# EAGLE design general_purpose_to247_hbridge_rev2 (EAGLE 6.1)
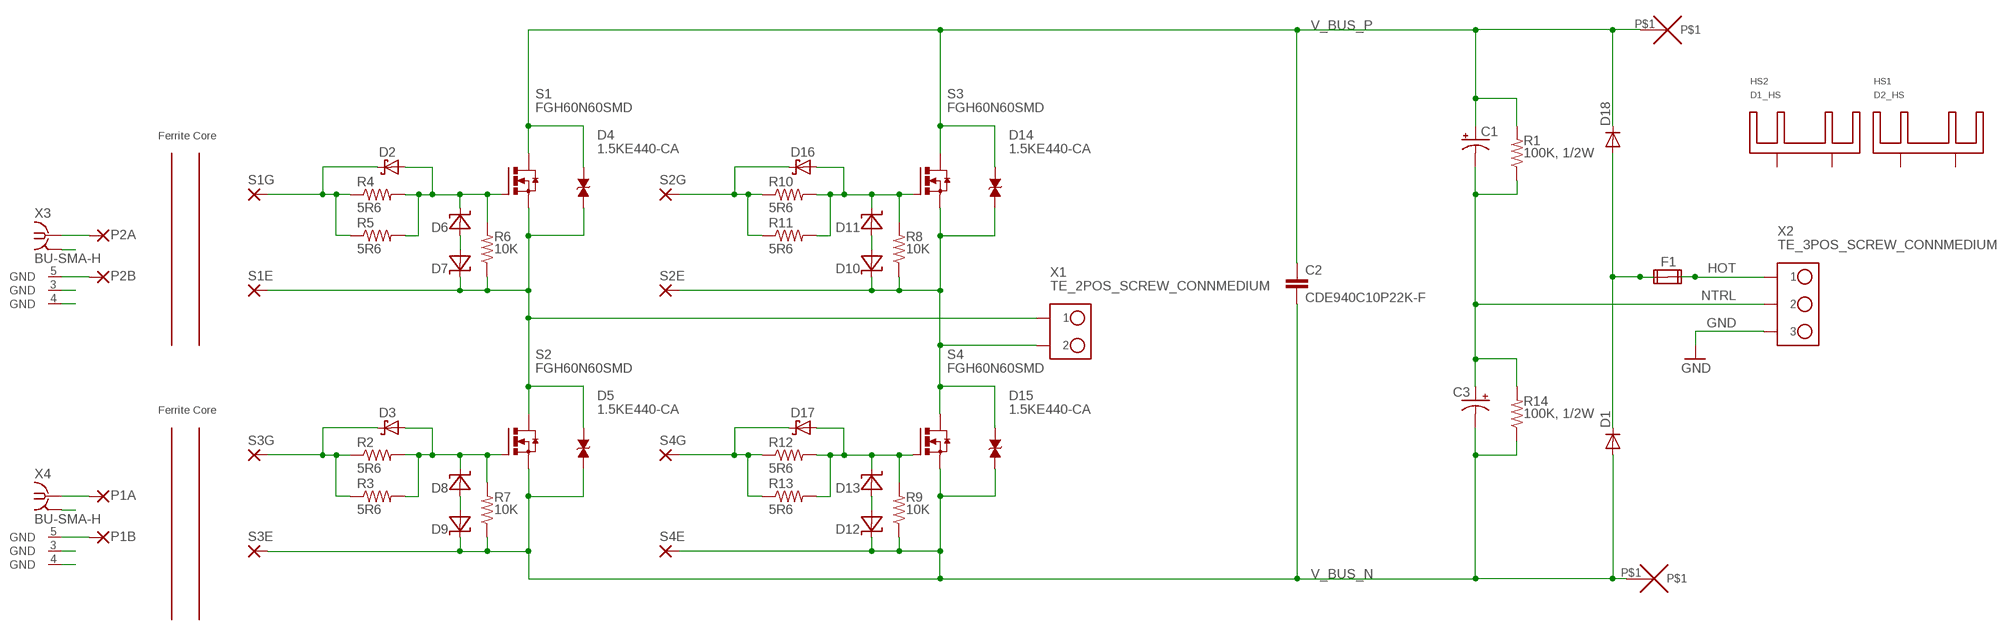
[diagram p0: schematic, sheet 1]

## Parts
C1  CPOL-USE10-35  [EB35D]
C2  CDE940C10P22K-F  [940C10P22K-F]
C3  CPOL-USE10-35  [EB35D]
D1  DIODE-DO220S  [DO220S]
D2  SCHOTTKY_SMA  [SMA]
D3  SCHOTTKY_SMA  [SMA]
D4  1.5KE440-CA  1.5KEXXX-CA  [DO-201_BI]
D5  1.5KE440-CA  1.5KEXXX-CA  [DO-201_BI]
D6  ZENER_SMA  [SMA]
D7  ZENER_SMA  [SMA]
D8  ZENER_SMA  [SMA]
D9  ZENER_SMA  [SMA]
D10  ZENER_SMA  [SMA]
D11  ZENER_SMA  [SMA]
D12  ZENER_SMA  [SMA]
D13  ZENER_SMA  [SMA]
D14  1.5KE440-CA  1.5KEXXX-CA  [DO-201_BI]
D15  1.5KE440-CA  1.5KEXXX-CA  [DO-201_BI]
D16  SCHOTTKY_SMA  [SMA]
D17  SCHOTTKY_SMA  [SMA]
D18  DIODE-DO220S  [DO220S]
F1  FUSE2P  [FUSE1]
HS1  D2_HS  HEATSINK_V6560R  [V6560_HEATSINK_REVERSED]
HS2  D1_HS  HEATSINK_V6560R  [V6560_HEATSINK_REVERSED]
P1A  SMD5  [SMD2,54-5,08]
P1B  SMD5  [SMD2,54-5,08]
P2A  SMD5  [SMD2,54-5,08]
P2B  SMD5  [SMD2,54-5,08]
R1  100K, 1/2W  R-US_0309/12  [0309/12]
R2  5R6  R-US_R2010  [R2010]
R3  5R6  R-US_R0805  [R0805]
R4  5R6  R-US_R2010  [R2010]
R5  5R6  R-US_R0805  [R0805]
R6  10K  R-US_R0805  [R0805]
R7  10K  R-US_R0805  [R0805]
R8  10K  R-US_R0805  [R0805]
R9  10K  R-US_R0805  [R0805]
R10  5R6  R-US_R2010  [R2010]
R11  5R6  R-US_R0805  [R0805]
R12  5R6  R-US_R2010  [R2010]
R13  5R6  R-US_R0805  [R0805]
R14  100K, 1/2W  R-US_0309/12  [0309/12]
S1  FGH60N60SMD  MOSFET-N_TO247  [TO247_H_NOHOLE]
S1E  SMD5  [SMD2,54-5,08]
S1G  SMD5  [SMD2,54-5,08]
S2  FGH60N60SMD  MOSFET-N_TO247  [TO247_H_NOHOLE]
S2E  SMD5  [SMD2,54-5,08]
S2G  SMD5  [SMD2,54-5,08]
S3  FGH60N60SMD  MOSFET-N_TO247  [TO247_H_NOHOLE]
S3E  SMD5  [SMD2,54-5,08]
S3G  SMD5  [SMD2,54-5,08]
S4  FGH60N60SMD  MOSFET-N_TO247  [TO247_H_NOHOLE]
S4E  SMD5  [SMD2,54-5,08]
S4G  SMD5  [SMD2,54-5,08]
U$1  12AWG_PAD  [12AWG_PAD]
U$2  GDT_SYMBOL  [GDT]
U$3  12AWG_PAD  [12AWG_PAD]
U$4  GDT_SYMBOL  [GDT]
X1  TE_2POS_SCREW_CONNMEDIUM  [OST_2POS_SCREW_CON_OSTYK51102030]
X2  TE_3POS_SCREW_CONNMEDIUM  [OST_2POS_SCREW_CON_SOTYK51103030]
X3  BU-SMA-H  [BU-SMA-H]
X4  BU-SMA-H  [BU-SMA-H]

## Nets
GND: X2.P$3
HOT: F1.2A F1.2B X2.P$1
N$1: X4.4(GND)
N$2: X4.3(GND)
N$3: P1B.1(P) X4.5(GND)
N$4: D1.C D18.A F1.1A F1.1B
N$5: D11.C D16.A R8.2 R10.2 R11.2 S3.G
N$6: P2B.1(P) X3.5(GND)
N$7: X3.4(GND)
N$8: D13.C D17.A R9.2 R12.2 R13.2 S4.G
N$9: D3.A D8.C R2.2 R3.2 R7.2 S2.G
N$10: D6.A D7.A
N$11: D2.A D6.C R4.2 R5.2 R6.2 S1.G
N$12: D8.A D9.A
N$13: D12.A D13.A
N$14: D10.A D11.A
N$15: P1A.1(P) X4.1
N$16: X3.3(GND)
N$17: P2A.1(P) X3.1
N$18: X4.2(GND)
N$19: X3.2(GND)
NTRL: C1.- C3.+ R1.1 R14.2 X2.P$2
S1E: D4.A D5.C D7.C R6.1 S1.S S1E.1(P) S2.D X1.P$1
S1G: D2.C R4.1 R5.1 S1G.1(P)
S2E: D10.C D14.A D15.C R8.1 S2E.1(P) S3.S S4.D X1.P$2
S2G: D16.C R10.1 R11.1 S2G.1(P)
S3G: D3.C R2.1 R3.1 S3G.1(P)
S4G: D17.C R12.1 R13.1 S4G.1(P)
V_BUS_N: C2.P$2 C3.- D1.A D5.A D9.C D12.C D15.A R7.1 R9.1 R14.1 S2.S S3E.1(P) S4.S S4E.1(P) U$1.P$1
V_BUS_P: C1.+ C2.P$1 D4.C D14.C D18.C R1.2 S1.D S3.D U$3.P$1
Unconnected: HS1.P$1(P1) HS1.P$2(P2) HS2.P$1(P1) HS2.P$2(P2)

## Library data of the parts
C1 C3 = resistor:CPOL-US: POLARIZED CAPACITOR, American symbol
C2 = Kramnik's Library:CDE940C10P22K-F
D1 D18 = diode:DIODE-: DIODE
D2 D3 D16 D17 = sc_usercreated:SCHOTTKY_SMA
D4 D5 D14 D15 = Kramnik's Library:1.5KEXXX-CA
D6-D13 = SC's Library:ZENER_SMA
F1 = special:FUSE2P: FUSE 5 x 20 mm
HS1 HS2 = Kramnik's Library:HEATSINK_V6560
P1A P1B P2A P2B S1E S1G S2E S2G S3E S3G S4E S4G = wirepad:SMD5: SMD PAD
R1-R14 = rcl:R-US_: RESISTOR, American symbol
S1-S4 = sc_usercreated:MOSFET-N_TO247
U$1 U$3 = onecoil:12AWG_PAD
U$2 U$4 = Kramnik's Library:GDT_SYMBOL
X1 = Kramnik's Library:TE_2POS_SCREW_CONN
X2 = Kramnik's Library:TE_3POS_SCREW_CONN
X3 X4 = con-coax:BU-SMA-H: FEMALE SMA CONNECTOR Radiall; OC_FARNELL: unknown; OC_NEWARK: unknown

## Net classes
0 default: width 0.229 mm, drill 0.381 mm, clearance 0.203 mm

## Board
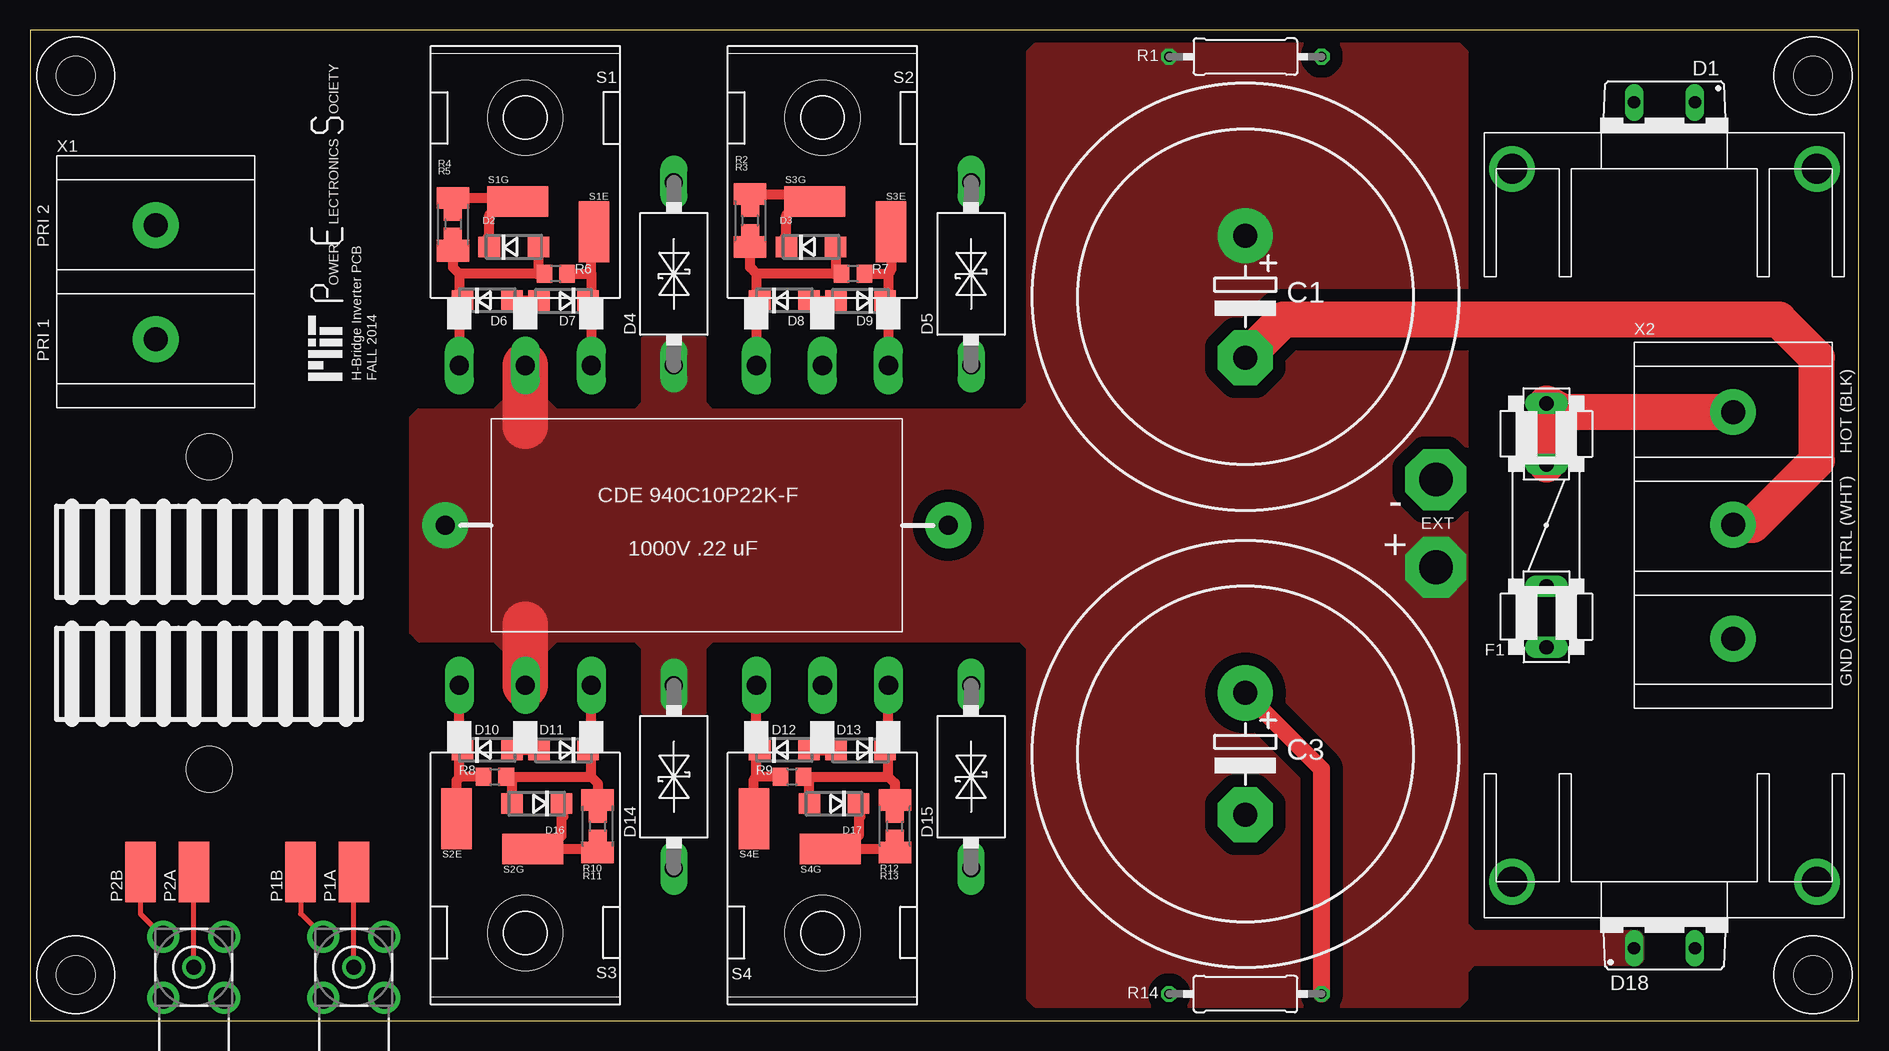
[diagram p1: board, top side]
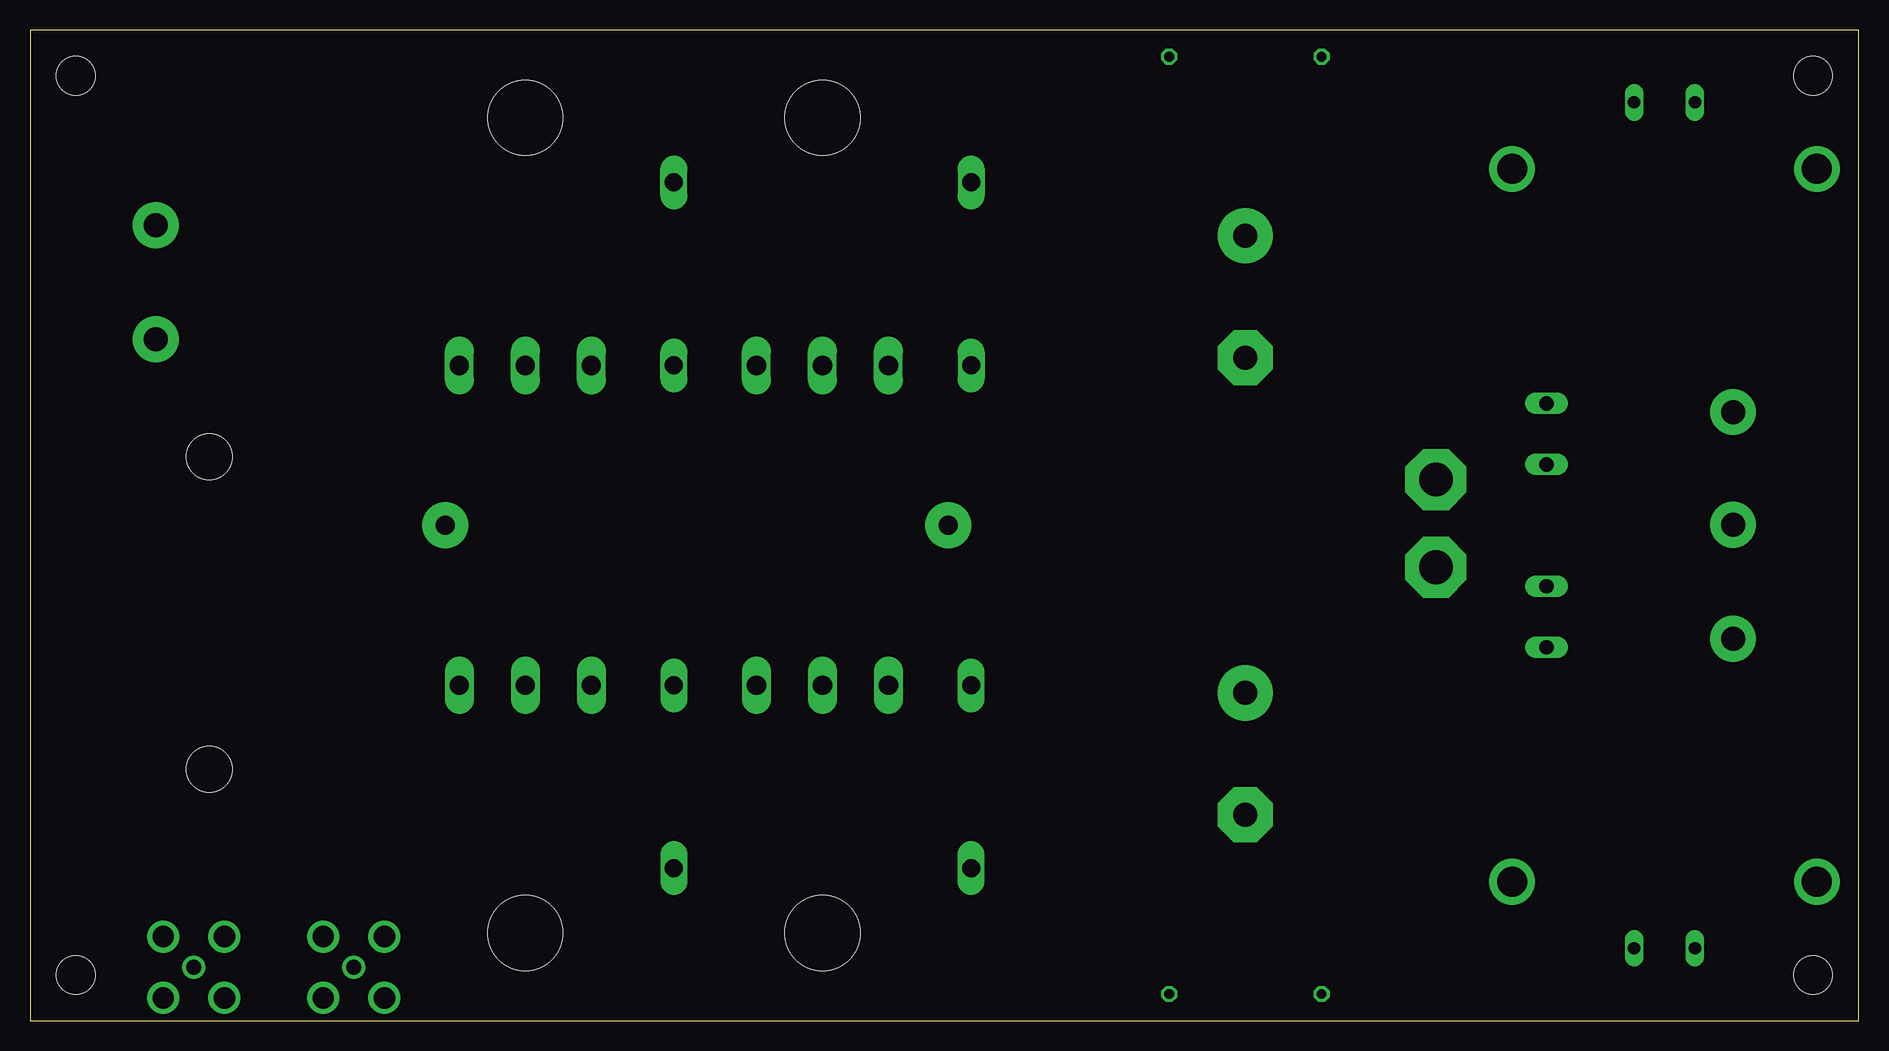
[diagram p2: board, inner layer Route2]
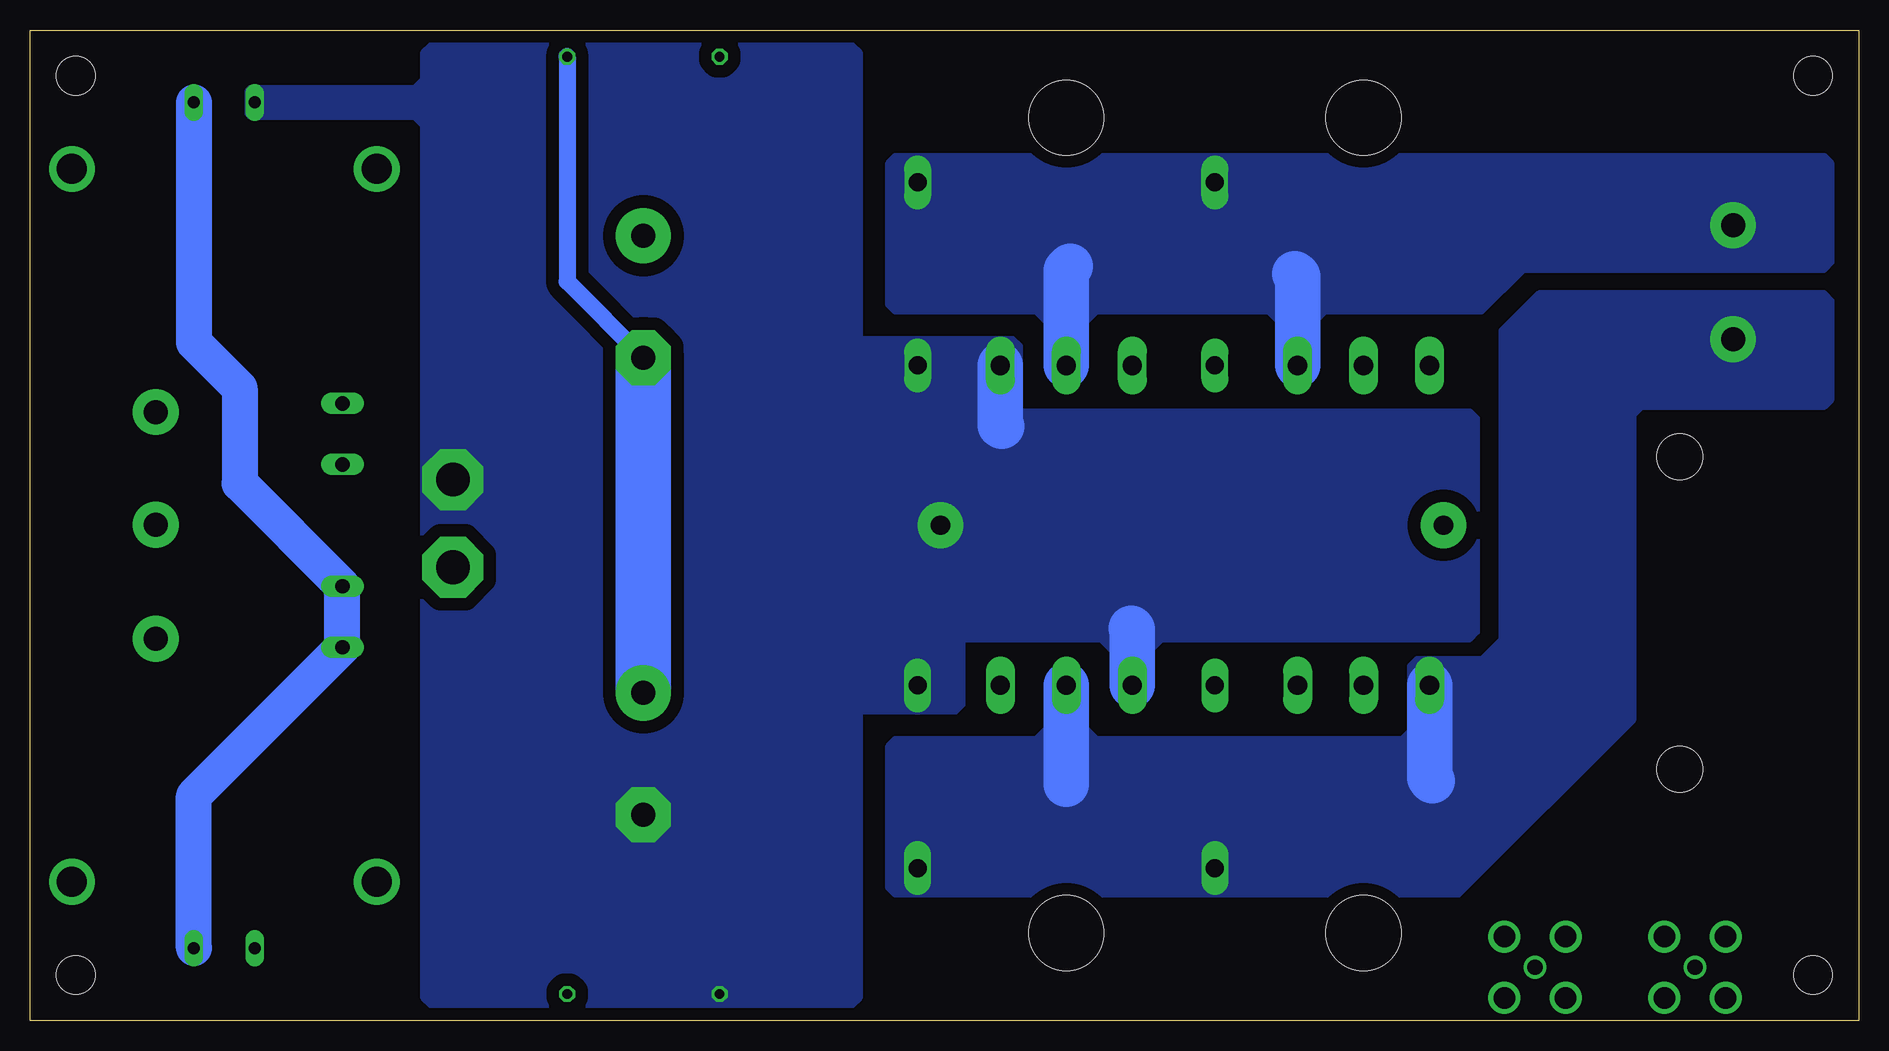
[diagram p3: board, bottom side, seen from below]

Size 152.4 x 82.55 mm. Coordinates in mm from the lower left corner, seen from the top.
Outline: 0,0 152.4,0 152.4,82.55 0,82.55 0,0
Copper layers (1*16): Top 0.035mm / dielectric 1.5mm / Bottom 0.035mm
Design rules: minimum track width 10mil, minimum drill 24mil, track to track 42mil, track to pad 42mil, pad to pad 42mil, via to via 42mil, smd to smd 42mil, copper to edge 40mil, drill to drill 8mil, minimum pad ring 10mil, minimum via ring 8mil, stop-mask expansion 4mil, vias tented up to drill 0mil, thermal gap 10mil
Holes 6.25 mm at 41.27,75.25 66.04,75.25 66.04,7.3 41.27,7.3
Holes 3.2 mm at 148.59,78.74 3.81,3.81 3.81,78.74 148.59,3.81
Holes 3.81 mm at 14.92,20.95 14.92,46.99

### Footprints (pad centres in the part's own frame; a part is rotated, then mirrored left to right if it is on the bottom)
EB35D = drill 2.007 pad 4.597: + -5.08,0 | drill 2.007 pad 4.597 octagon: - 5.08,0
940C10P22K-F = drill 1.6 pad 3.81: P$1 -20.955,0; P$2 20.955,0
DO220S = drill 1.016 long: A 2.54,-2.54; C -2.54,-2.54
SMA = smd 1.8 x 1.7: A 2.05,0; C -2.05,0
DO-201_BI = drill 1.499 long: A 7.62,0; C -7.62,0
FUSE1 = drill 1.194 long: 1A -10.16,0; 1B -5.08,0; 2A 10.16,0; 2B 5.08,0
V6560_HEATSINK_REVERSED = drill 2.5 pad 3.81: P$1 12.7,-3; P$2 -12.7,-3
SMD2,54-5,08 = smd 2.54 x 5.08: 1 0,0
0309/12 = drill 0.813 octagon: 1 -6.35,0; 2 6.35,0
R2010 = smd 1.8 x 2.7: 1 -2.2,0; 2 2.2,0
R0805 = smd 1.3 x 1.5: 1 -0.95,0; 2 0.95,0
TO247_H_NOHOLE = drill 1.6 long: D 0,-20.65; G -5.5,-20.65; S 5.5,-20.65
12AWG_PAD = drill 2.8 pad 5.08 octagon: P$1 0,0
OST_2POS_SCREW_CON_OSTYK51102030 = drill 2 pad 3.81: P$1 5.8,8.25; P$2 15.3,8.25
OST_2POS_SCREW_CON_SOTYK51103030 = drill 2 pad 3.81: P$1 5.8,8.25; P$2 15.2,8.25; P$3 24.7,8.25
BU-SMA-H = drill 1.27: 1 0,0 | drill 1.778: 2 -2.55,2.55; 3 2.55,2.55; 4 2.55,-2.55; 5 -2.55,-2.55

### Placement (x,y rotation side)
C1  101.28,60.33 270 top
C2  55.56,41.27 0 top
C3  101.28,22.23 270 top
D1  136.21,73.98 180 top
D2  40.32,64.45 0 top
D3  65.09,64.45 0 top
D4  53.66,62.23 90 top
D5  78.42,62.23 270 top
D6  38.1,60.01 0 top
D7  44.45,60.01 180 top
D8  62.87,60.01 0 top
D9  69.22,60.01 180 top
D10  38.1,22.54 0 top
D11  44.45,22.54 180 top
D12  62.87,22.54 0 top
D13  69.22,22.54 180 top
D14  53.66,20.32 270 top
D15  78.42,20.32 90 top
D16  42.23,18.1 180 top
D17  66.99,18.1 180 top
D18  136.21,8.57 0 top
F1  126.36,41.27 90 top
HS1  136.21,73.98 0 top
HS2  136.21,8.57 180 top
P1A  26.99,12.38 0 top
P1B  22.54,12.38 0 top
P2A  13.65,12.38 0 top
P2B  9.21,12.38 0 top
R1  101.28,80.33 180 top
R2  60.01,66.67 270 top
R3  60.01,66.67 270 top
R4  35.24,66.36 270 top
R5  35.24,66.36 270 top
R6  43.81,62.23 180 top
R7  68.58,62.23 180 top
R8  38.73,20.32 0 top
R9  63.5,20.32 0 top
R10  47.31,16.19 90 top
R11  47.31,16.19 90 top
R12  72.07,16.19 90 top
R13  72.07,16.19 90 top
R14  101.28,2.22 0 top
S1  41.27,75.25 0 top
S1E  46.99,65.72 0 top
S1G  40.64,68.26 270 top
S2  66.04,75.25 0 top
S2E  35.56,16.83 0 top
S2G  41.91,14.29 270 top
S3  41.27,7.3 180 top
S3E  71.75,65.72 0 top
S3G  65.41,68.26 270 top
S4  66.04,7.3 180 top
S4E  60.33,16.83 0 top
S4G  66.67,14.29 270 top
U$1  117.16,45.09 0 top
U$2  14.92,39.05 270 top
U$3  117.16,37.78 0 top
U$4  14.92,28.89 270 top
X1  2.22,72.07 270 top
X2  133.67,56.52 270 top
X3  13.65,4.45 270 top
X4  26.99,4.45 270 top

### Tracks (layer width: path | path; a pad name or v marks a point on that pad's centre or on a via)
GND1
  pour Route2: 66.04,-7.62 144.78,-7.62 144.78,-83.82 66.04,-83.82
HOT
  Top 2.985: F1.2B F1.2A 127.72,50.72 X2.P$1
N$3
  Top 0.406: P1B.1 22.54,8.89 X4.5
N$4
  Bottom 2.985: D18.A 138.75,18.73 F1.1A F1.1B 134.94,44.77 134.94,52.7 138.75,56.52 D1.C
N$5
  Top 0.813: R8.2 40.01,20.32 | 40.01,20.32 46.77,20.32 | 46.77,20.32 46.77,22.54 | 46.77,22.54 S3.G | D16.A 40.18,20.15 40.01,20.32 | D11.C 46.77,22.54 | 46.77,20.32 47.31,19.79 R10.2 R11.2
N$6
  Top 0.406: P2B.1 9.21,8.89 X3.5
N$8
  Top 0.813: R9.2 65.09,20.32 | 65.09,20.32 71.54,20.32 | 71.54,20.32 71.54,22.23 | 71.54,22.23 S4.G | D17.A 64.94,20.18 65.09,20.32 | D13.C 71.54,22.23 | 71.54,20.32 72.07,19.79 R12.2 R13.2
N$9
  Top 0.813: R7.2 66.99,62.23 | 66.99,62.23 60.54,62.23 | 60.54,62.23 60.54,60.01 | 60.54,60.01 S2.G | D8.C 60.54,60.01 | D3.A 67.14,62.38 66.99,62.23 | 60.54,62.23 60.01,62.76 R2.2 R3.2
N$10
  Top 0.813: D7.A D6.A
N$11
  Top 0.813: R6.2 42.23,62.23 | 42.23,62.23 35.77,62.23 | 35.77,62.23 35.77,60.01 | 35.77,60.01 S1.G | D6.C 35.77,60.01 | D2.A 42.37,62.38 42.23,62.23 | 35.77,62.23 35.24,62.76 R4.2 R5.2
N$12
  Top 0.813: D8.A D9.A
N$13
  Top 0.813: D12.A D13.A
N$14
  Top 0.813: D11.A D10.A
N$15
  Top 0.406: X4.1 P1A.1
N$17
  Top 0.406: X3.1 P2A.1
NTRL
  Top 1.422: R14.2 107.63,20.95 C3.+
  Top 2.985: X2.P$2 143.55,41.31 148.91,46.67 148.91,55.24 145.73,58.42 104.46,58.42 C1.-
  Bottom 1.422: R1.1 107.63,61.59 C1.-
  Bottom 4.636: C1.- C3.+
S1E
  Top 0.813: R6.1 46.77,62.23 | 46.77,62.23 46.77,60.01 | 46.77,60.01 S1.S | D7.C 46.77,60.01 | 46.77,62.23 46.77,65.51 S1E.1
  Bottom 3.81: S2.D 66.04,62.55 65.72,62.87 | S1.S 46.77,62.02 46.99,62.23
  pour Bottom (no thermals): 2.22,71.44 2.86,72.07 80.33,72.07 80.96,71.44 80.96,59.69 80.33,59.05 68.58,59.05 67.63,58.1 64.45,58.1 63.5,59.05 49.21,59.05 48.26,58.1 45.4,58.1 44.45,59.05 31.43,59.05 27.94,62.55 2.86,62.55 2.22,63.18
S1G
  Top 0.813: D2.C 38.27,65.09 | 38.27,65.09 38.27,67.17 39.37,68.26 39.69,68.26 | S1G.1 39.69,68.26 | 38.12,65.24 38.27,65.09 | 39.69,68.26 39.39,68.56 R4.1 R5.1
S2E
  Top 0.813: R8.1 35.88,20.32 | 35.88,20.32 35.77,20.32 35.77,22.54 | 35.77,22.54 S3.S | D10.C 35.77,22.54 | S2E.1 35.56,20 35.88,20.32
  Bottom 3.81: S3.S 35.77,20.22 35.56,20 | S4.D 66.04,19.68
  pour Bottom (no thermals): 18.73,25.08 18.73,50.48 18.1,51.12 2.86,51.12 2.22,51.75 2.22,60.01 2.86,60.64 26.67,60.64 29.84,57.47 29.84,31.75 31.43,30.16 36.83,30.16 37.47,29.53 37.47,24.13 38.1,23.5 63.5,23.5 64.45,24.45 67.63,24.45 68.58,23.5 80.33,23.5 80.96,22.86 80.96,11.11 80.33,10.48 33.34,10.48
S2G
  Top 0.813: D16.C 44.28,16.83 | 44.28,16.83 44.28,15.38 43.18,14.29 S2G.1 47.01,14.29 R10.1 R11.1 | 44.44,16.99 44.28,16.83
S3G
  Top 0.813: D3.C 63.04,65.41 | 63.04,65.41 63.04,67.17 64.14,68.26 64.77,68.26 | 62.87,65.24 63.04,65.41 | S3G.1 64.77,68.26 | 64.77,68.26 64.16,68.88 R2.1 R3.1
S4G
  Top 0.813: D17.C 69.04,17.14 | 69.04,17.14 69.04,15.38 67.94,14.29 S4G.1 71.78,14.29 R12.1 R13.1 | 69.19,16.99 69.04,17.14
V_BUS_N
  Top 0.813: R9.1 60.54,20.32 | 60.54,20.32 60.54,22.23 | 60.54,22.23 S4.S | R7.1 71.44,62.23 | 71.44,62.23 71.54,62.23 71.54,60.01 | 71.54,60.01 S2.S | D9.C 71.54,60.01 | D12.C 60.54,22.23 | S4E.1 60.33,20.11 60.54,20.32 | S3E.1 71.75,62.55 71.44,62.23
  Bottom 3.81: S2.S 71.54,49.63 71.44,49.53 | S4.S 60.54,32.6 60.64,32.7
  pour Bottom (no thermals): 31.75,50.16 32.38,50.8 69.85,50.8 69.85,56.2 70.48,56.83 83.19,56.83 83.19,80.64 83.82,81.28 119.06,81.28 119.7,80.64 119.7,1.91 119.06,1.27 83.82,1.27 83.19,1.91 83.19,25.72 75.25,25.72 74.61,26.35 74.61,31.75 63.18,31.75 62.23,30.8 59.05,30.8 58.1,31.75 32.38,31.75 31.75,32.38
  pour Bottom (no thermals): 119.06,78.42 119.06,74.61 119.7,74.61 120.33,75.25 133.99,75.25 134.3,75.56 134.3,77.47 133.99,77.79 120.33,77.79 119.7,78.42
V_BUS_P
  Top 3.81: S1.D 41.27,49.53 | S3.D 41.27,33.02
  pour Top (no thermals): 32.38,50.8 31.75,50.16 31.75,32.38 32.38,31.75 38.73,31.75 39.69,30.8 42.86,30.8 43.81,31.75 50.48,31.75 51.12,31.11 51.12,25.72 56.2,25.72 56.2,31.11 56.83,31.75 82.55,31.75 83.19,31.11 83.19,1.91 83.82,1.27 119.06,1.27 119.7,1.91 119.7,80.64 119.06,81.28 83.82,81.28 83.19,80.64 83.19,51.44 82.55,50.8 56.83,50.8 56.2,51.44 56.2,56.83 51.12,56.83 51.12,51.44 50.48,50.8 43.81,50.8 42.86,51.75 39.69,51.75 38.73,50.8
  pour Top (no thermals): 119.06,7.94 119.06,4.13 119.7,4.13 120.33,4.76 133.99,4.76 134.3,5.08 134.3,6.99 133.99,7.3 120.33,7.3 119.7,7.94

### Text on the board
tPlace: PRI 2 | PRI 1 | HOT (BLK) | NTRL (WHT) | GND (GRN)
tNames: OCIETY | LECTRONICS | OWER | H-Bridge Inverter PCB | FALL 2014 | - | EXT | +